# Altium project H2_expansion.PrjPcb
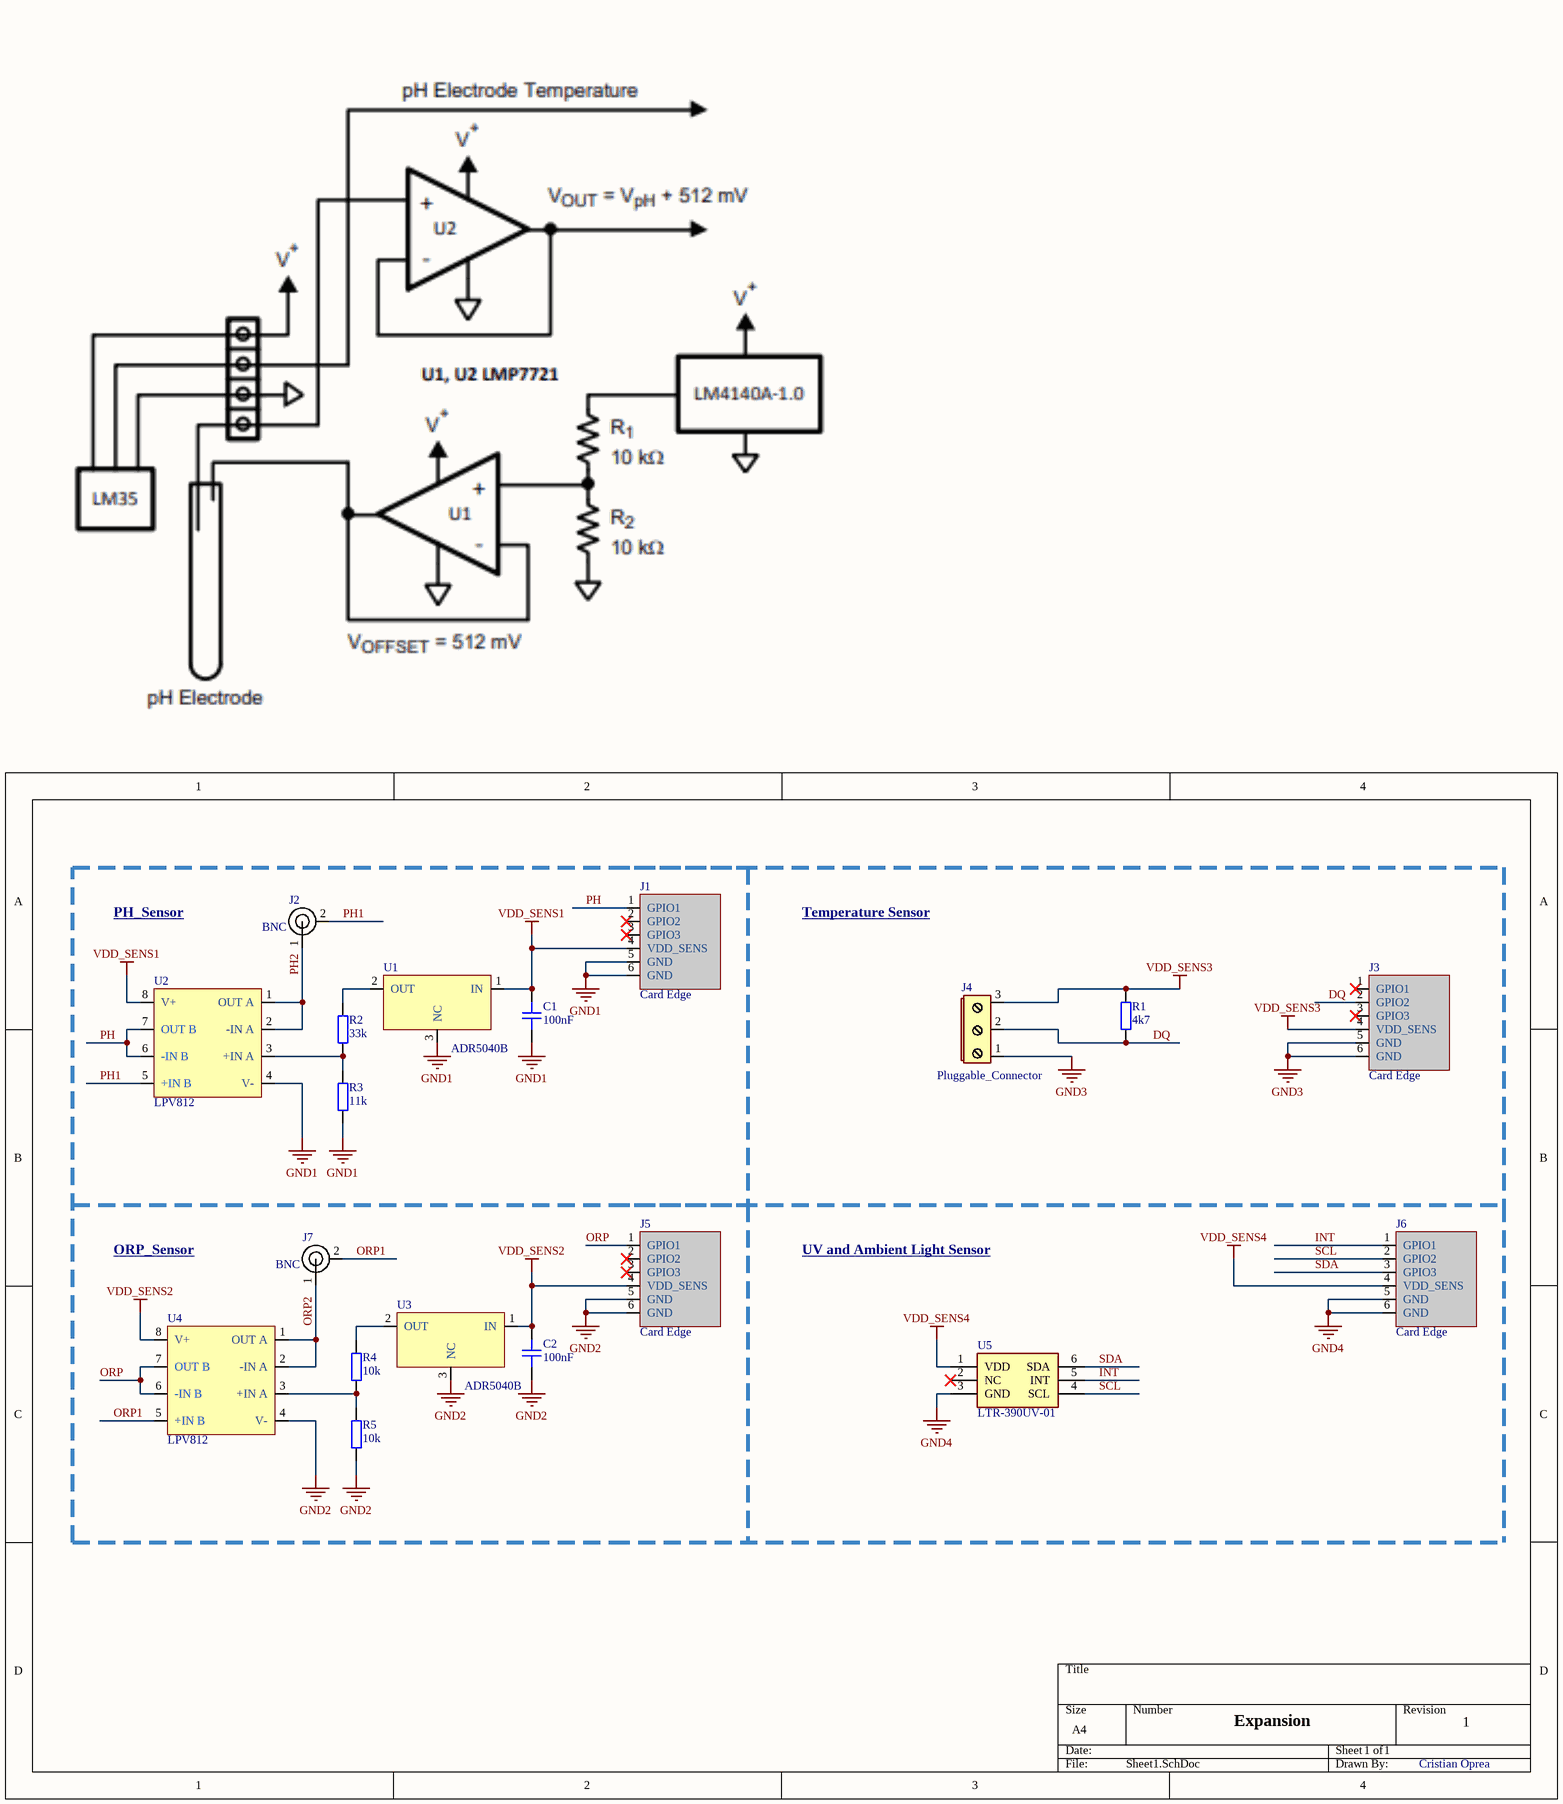
[diagram p0: Sheet1.SchDoc]
1 sheet, 19 parts. Net scope: global (net labels, ports and power ports of the same name join across sheets).
Board file: PCB2.PcbDoc

## Sheet Sheet1.SchDoc
size A4; SheetNumber: 1; SheetTotal: 1

### Parts
C1  100nF  [C0603]
C2  100nF  [C0603]
J1  Card Edge  [Card Edge]
J2  BNC  [CON_BNC_MOLEX_0731375003]
J3  Card Edge  [Card Edge]
J4  Pluggable_Connector
J5  Card Edge  [Card Edge]
J6  Card Edge  [Card Edge]
J7  BNC  [CON_BNC_MOLEX_0731375003]
R1  4k7  [C0603]
R2  33k  [C0603]
R3  11k  [C0603]
R4  10k  [C0603]
R5  10k  [C0603]
U1  ADR5040B  [SOT23-3]
U2  LPV812  [VSSOP 8]
U3  ADR5040B  [SOT23-3]
U4  LPV812  [VSSOP 8]
U5  LTR-390UV-01  [LTR390UV01]

### Nets
GND1: C1.1 J1.5(GND) J1.6(GND) R3.1 U1.3(NC) U2.4(V-)
GND2: C2.1 J5.5(GND) J5.6(GND) R5.1 U3.3(NC) U4.4(V-)
GND3: J3.5(GND) J3.6(GND) J4.1
GND4: J6.5(GND) J6.6(GND) U5.3(GND)
VDD_SENS1: C1.2 J1.4(VDD_SENS) U1.1(IN) U2.8(V+)
VDD_SENS2: C2.2 J5.4(VDD_SENS) U3.1(IN) U4.8(V+)
VDD_SENS3: J3.4(VDD_SENS) J4.3 R1.2
VDD_SENS4: J6.4(VDD_SENS) U5.1(VDD)
DQ: J3.2(GPIO2) J4.2 R1.1
INT: J6.1(GPIO1) U5.5(INT)
ORP: J5.1(GPIO1) U4.6(-IN_B) U4.7(OUT_B)
ORP1: J7.2 U4.5(+IN_B)
ORP2: J7.1 U4.1(OUT_A) U4.2(-IN_A)
PH: J1.1(GPIO1) U2.6(-IN_B) U2.7(OUT_B)
PH1: J2.2 U2.5(+IN_B)
PH2: J2.1 U2.1(OUT_A) U2.2(-IN_A)
SCL: J6.2(GPIO2) U5.4(SCL)
SDA: J6.3(GPIO3) U5.6(SDA)
NetR2_1: R2.1 R3.2 U2.3(+IN_A)
NetR2_2: R2.2 U1.2(OUT)
NetR4_1: R4.1 R5.2 U4.3(+IN_A)
NetR4_2: R4.2 U3.2(OUT)

Not connected (* = marked no-connect by the designer): J1 2(GPIO2)* 3(GPIO3)*; J3 1(GPIO1)* 3(GPIO3)*; J5 2(GPIO2)* 3(GPIO3)*; U5 2(NC)*

### Notes on the sheet
- PH_Sensor
- Temperature Sensor
- ORP_Sensor
- UV and Ambient Light Sensor
- Expansion
- 1
- Cristian Oprea

### Library data of the parts
C1 C2 = CAP_0603: Capacitor SMD 0603; Manufacturer: *; Manufacturer Part Number: *; Distributor Link: *; LCSC: *; Rating: *; Dielectric: *
J1 J3 J5 J6 = Card Edge: Card Edge pads for 2.54 mm pitch edge connector
J2 J7 = CON-BNC: RF Connector BNC Female 50 Ohms PCB TH Mount; Manufacturer: RF Solutions; Manufacturer Part Number: CON-SMA-EDGE-S
J4 = Pluggable_Connector: Screw terminal or plug terminal
R1-R5 = RES_0805: Resistor SMD 0805; Manufacturer: *; Manufacturer Part Number: *; Distributor Link: *; LCSC: *
U1 U3 = VREF: Voltage References 2.048 Low-Cost, Micropower, Low-Dropout, High-Output-Current, SOT23; Manufacturer: Maxim Integrated; Manufacturer Part Number: MAX6101EUR+T
U2 U4 = LPV812: Dual Channel 425nA Precision Nanopower Operational Amplifiers
U5 = LTR-390UV-01: SENSOR OPT ULTRAVIOLET 6PINS; Manufacturer_Name: Lite-On; Geometry.Height: 0.9mm; Manufacturer_Part_Number: LTR-390UV-01; Mouser Part Number: 859-LTR390UV01; Mouser Price/Stock: https://www.mouser.co.uk/ProductDetail/Lite-On/LTR-390UV-01?qs=g5ciJ0jwZaECcUd5i6p7%252Bg%3D%3D; Arrow Part Number: LTR-390UV-01; Arrow Price/Stock: https://www.arrow.com/en/products/ltr-390uv-01/lite-on-technology?region=nac; Datasheet Link: https://www.arrow.com/en/products/ltr-390uv-01/lite-on-technology